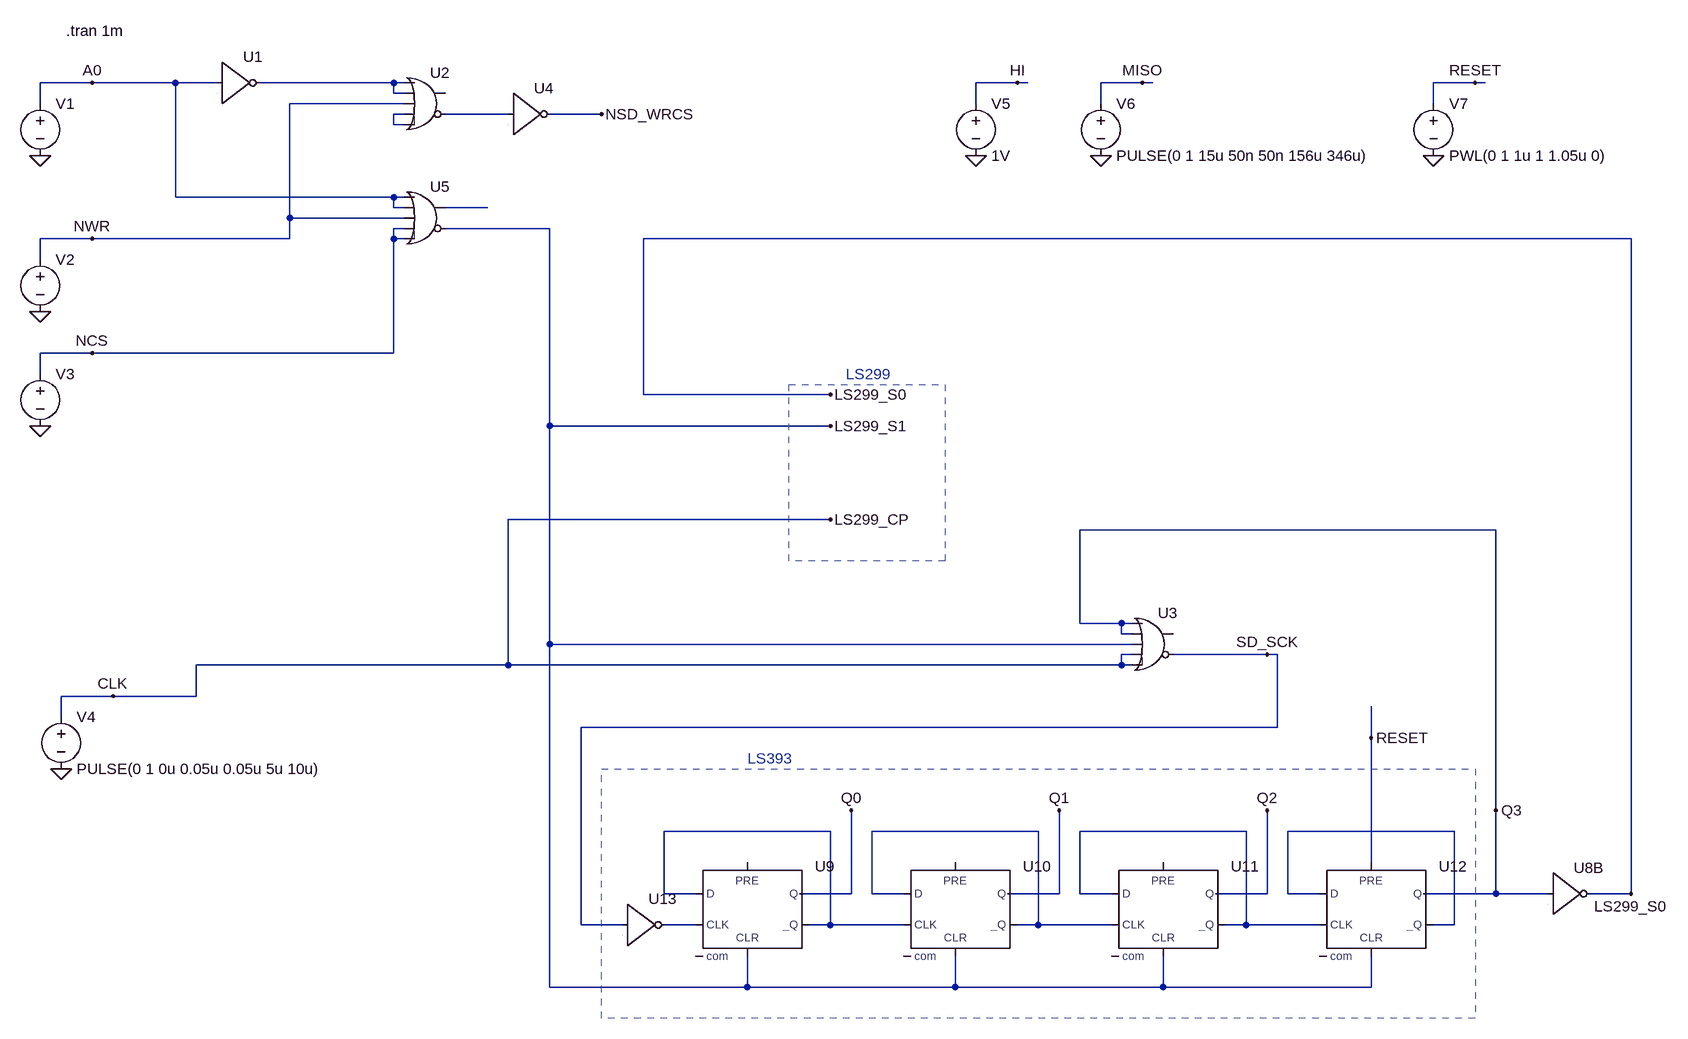
[diagram p0: schematic SD_interface.asc]
SD_interface.asc, the LTspice schematic file:
Version 4
SHEET 1 3020 1428
WIRE 48 -64 -32 -64
WIRE 176 -64 48 -64
WIRE 240 -64 176 -64
WIRE 512 -64 304 -64
WIRE 528 -64 512 -64
WIRE 1472 -64 1408 -64
WIRE 1488 -64 1472 -64
WIRE 1664 -64 1600 -64
WIRE 1680 -64 1664 -64
WIRE 2176 -64 2112 -64
WIRE 2192 -64 2176 -64
WIRE 512 -48 512 -64
WIRE 528 -48 512 -48
WIRE -32 -32 -32 -64
WIRE 528 -32 352 -32
WIRE 1408 -32 1408 -64
WIRE 1600 -32 1600 -64
WIRE 2112 -32 2112 -64
WIRE 528 -16 512 -16
WIRE 688 -16 592 -16
WIRE 832 -16 752 -16
WIRE 512 0 512 -16
WIRE 528 0 512 0
WIRE 176 112 176 -64
WIRE 512 112 176 112
WIRE 528 112 512 112
WIRE 512 128 512 112
WIRE 528 128 512 128
WIRE 656 128 592 128
WIRE 352 144 352 -32
WIRE 528 144 352 144
WIRE 528 160 512 160
WIRE 752 160 592 160
WIRE 48 176 -32 176
WIRE 352 176 352 144
WIRE 352 176 48 176
WIRE 512 176 512 160
WIRE 528 176 512 176
WIRE 2416 176 896 176
WIRE -32 208 -32 176
WIRE 48 352 -32 352
WIRE 512 352 512 176
WIRE 512 352 48 352
WIRE -32 384 -32 352
WIRE 896 416 896 176
WIRE 1184 416 896 416
WIRE 752 464 752 160
WIRE 1184 464 752 464
WIRE 1184 608 688 608
WIRE 2208 624 1568 624
WIRE 1568 768 1568 624
WIRE 1632 768 1568 768
WIRE 1648 768 1632 768
WIRE 1632 784 1632 768
WIRE 1648 784 1632 784
WIRE 752 800 752 464
WIRE 1648 800 752 800
WIRE 1648 816 1632 816
WIRE 1856 816 1712 816
WIRE 1872 816 1856 816
WIRE 688 832 688 608
WIRE 688 832 208 832
WIRE 1632 832 1632 816
WIRE 1632 832 688 832
WIRE 1648 832 1632 832
WIRE 80 880 0 880
WIRE 208 880 208 832
WIRE 208 880 80 880
WIRE 0 912 0 880
WIRE 1872 928 1872 816
WIRE 1872 928 800 928
WIRE 2016 944 2016 896
WIRE 2208 1056 2208 624
WIRE 1184 1088 928 1088
WIRE 1504 1088 1248 1088
WIRE 1824 1088 1568 1088
WIRE 2144 1088 1888 1088
WIRE 2016 1136 2016 944
WIRE 928 1184 928 1088
WIRE 976 1184 928 1184
WIRE 1216 1184 1216 1056
WIRE 1216 1184 1136 1184
WIRE 1248 1184 1248 1088
WIRE 1296 1184 1248 1184
WIRE 1536 1184 1536 1056
WIRE 1536 1184 1456 1184
WIRE 1568 1184 1568 1088
WIRE 1616 1184 1568 1184
WIRE 1856 1184 1856 1056
WIRE 1856 1184 1776 1184
WIRE 1888 1184 1888 1088
WIRE 1936 1184 1888 1184
WIRE 2208 1184 2208 1056
WIRE 2208 1184 2096 1184
WIRE 2288 1184 2208 1184
WIRE 2416 1184 2416 176
WIRE 2416 1184 2352 1184
WIRE 800 1232 800 928
WIRE 864 1232 800 1232
WIRE 976 1232 928 1232
WIRE 1184 1232 1184 1088
WIRE 1184 1232 1152 1232
WIRE 1296 1232 1184 1232
WIRE 1504 1232 1504 1088
WIRE 1504 1232 1472 1232
WIRE 1616 1232 1504 1232
WIRE 1824 1232 1824 1088
WIRE 1824 1232 1792 1232
WIRE 1936 1232 1824 1232
WIRE 2144 1232 2144 1088
WIRE 2144 1232 2112 1232
WIRE 752 1328 752 800
WIRE 1056 1328 1056 1280
WIRE 1056 1328 752 1328
WIRE 1376 1328 1376 1280
WIRE 1376 1328 1056 1328
WIRE 1696 1328 1696 1280
WIRE 1696 1328 1376 1328
WIRE 2016 1328 2016 1280
WIRE 2016 1328 1696 1328
FLAG -32 48 0
FLAG -32 288 0
FLAG -32 464 0
FLAG 48 -64 A0
FLAG 48 176 NWR
FLAG 48 352 NCS
FLAG 0 992 0
FLAG 80 880 CLK
FLAG 1408 48 0
FLAG 1472 -64 HI
FLAG 1856 816 SD_SCK
FLAG 1184 608 LS299_CP
FLAG 1184 464 LS299_S1
FLAG 1216 1056 Q0
FLAG 1536 1056 Q1
FLAG 1856 1056 Q2
FLAG 2208 1056 Q3
FLAG 1600 48 0
FLAG 1664 -64 MISO
FLAG 2112 48 0
FLAG 2176 -64 RESET
FLAG 832 -16 NSD_WRCS
FLAG 2416 1184 LS299_S0
FLAG 1184 416 LS299_S0
FLAG 2016 944 RESET
SYMBOL voltage -32 -48 R0
WINDOW 3 24 96 Invisible 2
WINDOW 123 0 0 Left 0
WINDOW 39 0 0 Left 0
SYMATTR Value PWL(0 1 101u 1 101.05u 0)
SYMATTR InstName V1
SYMBOL Digital\\inv 240 -128 R0
WINDOW 3 8 60 Invisible 2
SYMATTR Value td=50n
SYMATTR InstName U1
SYMBOL Digital\\or 560 -96 R0
WINDOW 3 -8 36 Invisible 2
SYMATTR Value td=50n
SYMATTR InstName U2
SYMBOL voltage -32 192 R0
WINDOW 3 24 96 Invisible 2
WINDOW 123 0 0 Left 0
WINDOW 39 0 0 Left 0
SYMATTR Value PWL(0 1 15u 1 15.05u 0 20u 0 25u 0 25.05u 1 615u 1 615.05u 0 620u 0 625u 0 625.05u 1)
SYMATTR InstName V2
SYMBOL voltage -32 368 R0
WINDOW 3 24 96 Invisible 2
WINDOW 123 0 0 Left 0
WINDOW 39 0 0 Left 0
SYMATTR Value PWL(0 1 10u 1 10.05u 0 20u 0 25u 0 25.05u 1 610u 1 610.05u 0 620u 0 625u 0 625.05u 1)
SYMATTR InstName V3
SYMBOL Digital\\or 560 80 R0
WINDOW 3 -8 36 Invisible 2
SYMATTR Value td=50n
SYMATTR InstName U5
SYMBOL voltage 0 896 R0
WINDOW 123 0 0 Left 0
WINDOW 39 0 0 Left 0
SYMATTR InstName V4
SYMATTR Value PULSE(0 1 0u 0.05u 0.05u 5u 10u)
SYMBOL Digital\\inv 2288 1120 R0
WINDOW 3 8 104 Invisible 2
SYMATTR Value td=50n
SYMATTR InstName U8B
SYMBOL Digital\\dflop 1056 1136 R0
WINDOW 3 8 168 Invisible 2
SYMATTR Value td=50n
SYMATTR InstName U9
SYMBOL Digital\\dflop 1376 1136 R0
WINDOW 3 8 168 Invisible 2
SYMATTR Value td=50n
SYMATTR InstName U10
SYMBOL Digital\\dflop 1696 1136 R0
WINDOW 3 8 168 Invisible 2
SYMATTR Value td=50n
SYMATTR InstName U11
SYMBOL Digital\\dflop 2016 1136 R0
WINDOW 3 8 168 Invisible 2
SYMATTR Value td=50n
SYMATTR InstName U12
SYMBOL Digital\\inv 864 1168 R0
WINDOW 3 8 104 Invisible 2
SYMATTR Value td=50n
SYMATTR InstName U13
SYMBOL voltage 1408 -48 R0
SYMATTR InstName V5
SYMATTR Value 1V
SYMBOL voltage 1600 -48 R0
WINDOW 123 0 0 Left 0
WINDOW 39 0 0 Left 0
SYMATTR InstName V6
SYMATTR Value PULSE(0 1 15u 50n 50n 156u 346u)
SYMBOL voltage 2112 -48 R0
WINDOW 123 0 0 Left 0
WINDOW 39 0 0 Left 0
SYMATTR InstName V7
SYMATTR Value PWL(0 1 1u 1 1.05u 0)
SYMBOL Digital\\or 1680 736 R0
WINDOW 3 -8 36 Invisible 2
SYMATTR Value td=50n
SYMATTR InstName U3
SYMBOL Digital\\inv 688 -80 R0
WINDOW 3 8 60 Invisible 2
SYMATTR Value td=50n
SYMATTR InstName U4
TEXT 8 -144 Left 2 !.tran 1m
TEXT 1208 384 Left 2 ;LS299
TEXT 1056 976 Left 2 ;LS393
RECTANGLE Normal 1360 672 1120 400 2
RECTANGLE Normal 2176 1376 832 992 2

The netlist it stands for:
* SD_interface.asc
V1 A0 0 PWL(0 1 101u 1 101.05u 0)
A§U1 A0 0 0 0 0 N001 0 0 BUF td=50n
A§U2 N001 N001 NWR N002 N002 N003 0 0 OR td=50n
V2 NWR 0 PWL(0 1 15u 1 15.05u 0 20u 0 25u 0 25.05u 1 615u 1 615.05u 0 620u 0 625u 0 625.05u 1)
V3 NCS 0 PWL(0 1 10u 1 10.05u 0 20u 0 25u 0 25.05u 1 610u 1 610.05u 0 620u 0 625u 0 625.05u 1)
A§U5 A0 A0 NWR NCS NCS LS299_S1 N004 0 OR td=50n
V4 LS299_CP 0 PULSE(0 1 0u 0.05u 0.05u 5u 10u)
A§U8B Q3 0 0 0 0 LS299_S0 0 0 BUF td=50n
A§U9 N005 0 N009 0 LS299_S1 N005 Q0 0 DFLOP td=50n
A§U10 N006 0 N005 0 LS299_S1 N006 Q1 0 DFLOP td=50n
A§U11 N007 0 N006 0 LS299_S1 N007 Q2 0 DFLOP td=50n
A§U12 N008 0 N007 RESET LS299_S1 N008 Q3 0 DFLOP td=50n
A§U13 SD_SCK 0 0 0 0 N009 0 0 BUF td=50n
V5 HI 0 1V
V6 MISO 0 PULSE(0 1 15u 50n 50n 156u 346u)
V7 RESET 0 PWL(0 1 1u 1 1.05u 0)
A§U3 Q3 Q3 LS299_S1 LS299_CP LS299_CP SD_SCK 0 0 OR td=50n
A§U4 N003 0 0 0 0 NSD_WRCS 0 0 BUF td=50n
.tran 1m
* LS299
* LS393
.backanno
.end